# EAGLE design wifi_fixer (EAGLE 9.5.2)
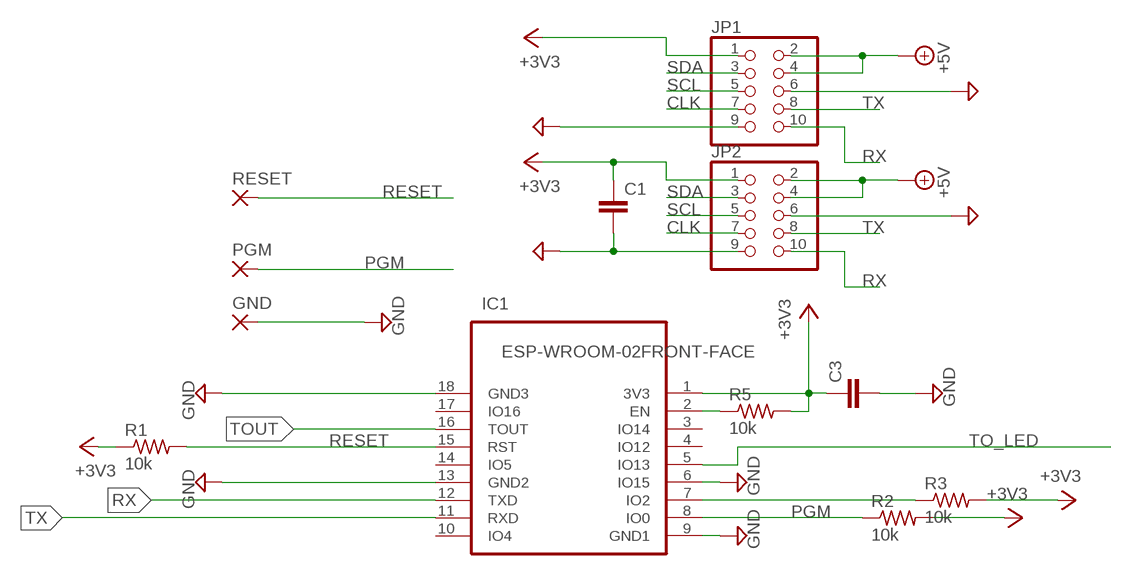
[diagram p0: schematic, sheet 1]

## Parts
C1  C-EUC1206  [C1206]
C3  C-EUC0603  [C0603]
GND  SMD2  [SMD1,27-2,54]
IC1  ESP-WROOM-02FRONT-FACE  [FRONT-FACE]
JP1  PINHD-2X5  [2X05]
JP2  PINHD-2X5  [2X05]
PGM  SMD2  [SMD1,27-2,54]
R1  10k  R-US_R0603  [R0603]
R2  10k  R-US_R0603  [R0603]
R3  10k  R-US_R0603  [R0603]
R5  10k  R-US_R0603  [R0603]
RESET  SMD2  [SMD1,27-2,54]

## Nets
+3V3: C1.1 C3.1 IC1.1(3V3) JP1.1 JP2.1 R1.1 R2.2 R3.2 R5.2
+5V: JP1.2 JP1.4 JP2.2 JP2.4
CLK: JP1.7 JP2.7
GND: C1.2 C3.2 GND.1(P) IC1.6(IO15) IC1.9(GND1) IC1.13(GND2) IC1.18(GND3) JP1.6 JP1.9 JP2.6 JP2.9
N$2: IC1.7(IO2) R3.1
N$5: IC1.2(EN) R5.1
PGM: IC1.8(IO0) PGM.1(P) R2.1
RESET: IC1.15(RST) R1.2 RESET.1(P)
RX: IC1.12(TXD) JP1.10 JP2.10
SCL: JP1.5 JP2.5
SDA: JP1.3 JP2.3
TO_LED: IC1.5(IO13)
TOUT: IC1.16(TOUT)
TX: IC1.11(RXD) JP1.8 JP2.8
Unconnected: IC1.3(IO14) IC1.4(IO12) IC1.10(IO4) IC1.14(IO5) IC1.17(IO16)

## Library data of the parts
C1 C3 = rcl:C-EU: CAPACITOR, European symbol
GND PGM RESET = wirepad:SMD2: SMD PAD
IC1 = esp-wroom-02:ESP-WROOM-02: WiFi module - ESP-WROOM-02
JP1 JP2 = pinhead:PINHD-2X5: PIN HEADER
R1-R3 R5 = rcl:R-US_: RESISTOR, American symbol

## Board
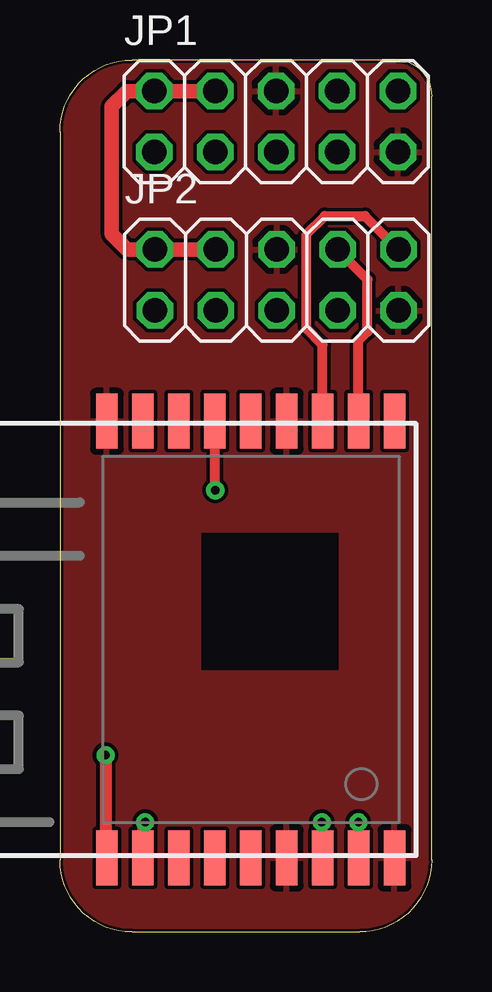
[diagram p1: board, top side]
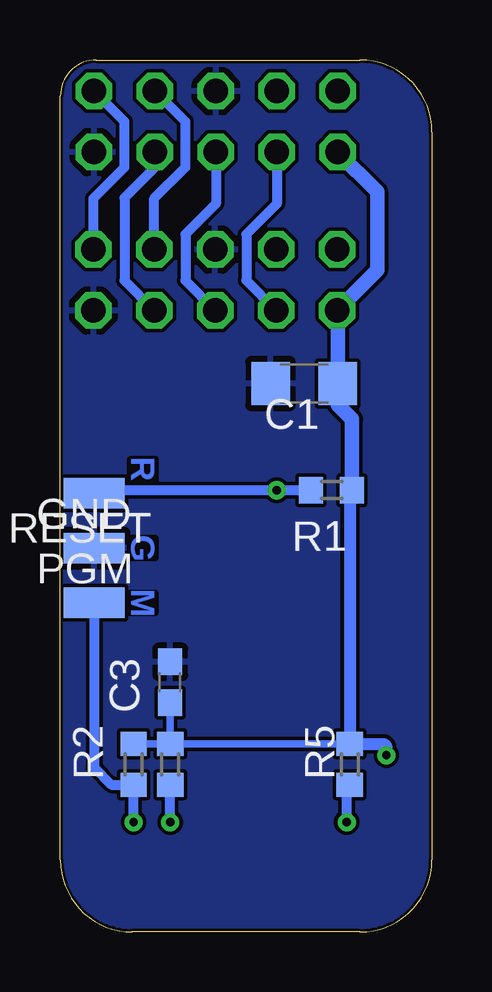
[diagram p2: board, bottom side, seen from below]

Size 15.5 x 36.35 mm. Coordinates in mm from the lower left corner, seen from the top.
Outline: 3,0 12.5,0 arc90 15.5,3 15.5,34.85 arc90 14,36.35 3,36.35 arc90 0,33.35 0,3 arc90 3,0
Copper layers (1*16): Top 0.035mm / dielectric 0.15mm / Bottom 0.035mm
Design rules "default *": minimum track width 6mil, minimum drill 0.35mm, track to track 6mil, track to pad 6mil, pad to pad 6mil, via to via 6mil, smd to smd 6mil, copper to edge 5mil, drill to drill 6mil, minimum pad ring 10mil, minimum via ring 8mil, stop-mask expansion 4mil, vias tented up to drill 0mil, thermal gap 10mil

### Footprints (pad centres in the part's own frame; a part is rotated, then mirrored left to right if it is on the bottom)
C1206 = smd 1.6 x 1.8: 1 -1.4,0; 2 1.4,0
C0603 = smd 1.1 x 1: 1 -0.85,0; 2 0.85,0
SMD1,27-2,54 = smd 1.27 x 2.54: 1 0,0
FRONT-FACE = smd 2.3 x 0.9: 1 -9.1,4.9; 2 -9.1,3.4; 3 -9.1,1.9; 4 -9.1,0.4; 5 -9.1,-1.1; 6 -9.1,-2.6; 7 -9.1,-4.1; 8 -9.1,-5.6; 9 -9.1,-7.1; 10 9.1,-7.1; 11 9.1,-5.6; 12 9.1,-4.1; 13 9.1,-2.6; 14 9.1,-1.1; 15 9.1,0.4; 16 9.1,1.9; 17 9.1,3.4; 18 9.1,4.9
2X05 = drill 1.016 octagon: 1 -5.08,-1.27; 2 -5.08,1.27; 3 -2.54,-1.27; 4 -2.54,1.27; 5 0,-1.27; 6 0,1.27; 7 2.54,-1.27; 8 2.54,1.27; 9 5.08,-1.27; 10 5.08,1.27
R0603 = smd 1 x 1.1: 1 -0.85,0; 2 0.85,0

### Placement (x,y rotation side)
C1  5.33,22.86 180 bottom
C3  10.92,10.41 90 bottom
GND  14.1,16 270 bottom
IC1  6.86,12.19 90 top
JP1  9.02,33.78 0 top
JP2  9.04,27.18 0 top
PGM  14.1,13.72 270 bottom
R1  4.19,18.41 180 bottom
R2  12.45,6.99 90 bottom
R3  10.92,6.99 90 bottom
R5  3.43,6.99 90 bottom
RESET  14.1,18.29 90 bottom

### Tracks (layer width: path | path; a pad name or v marks a point on that pad's centre or on a via)
+3V3  (via drill 0.35)
  Top 0.508: v1.91,7.37 1.91,3.15 IC1.1
  Bottom 0.305: R5.2 R3.2 | R3.2 C3.1 | R2.2 R3.2
  Bottom 0.508: R1.1 3.43,18.33 R5.2 1.99,7.83 1.91,7.75 v1.91,7.37
  Bottom 0.61: JP1.1 2.29,30.86 2.29,27.58 JP2.1 3.93,25.88 C1.1 3.93,21.97 3.34,21.38 R1.1
+5V
  Top 0.61: JP1.4 JP1.2 2.79,35.05 2.16,34.42 2.16,29.08 2.79,28.45 JP2.2 JP2.4
CLK
  Bottom 0.406: JP1.7 11.56,31.88 12.83,30.61 12.83,27.15 JP2.7
GND
  pour Top: -1.02,38.1 17.02,38.1 17.02,-1.78 -1.02,-1.78
  pour Bottom: -2.03,38.35 16.51,38.35 16.51,-2.03 -2.03,-2.03
N$2  (via drill 0.35)
  Top 0.406: IC1.7 10.96,4.54 v10.92,4.57
  Bottom 0.406: v10.92,4.57 R3.1
N$5  (via drill 0.35)
  Top 0.406: IC1.2 3.46,4.35 3.56,4.45 v3.56,4.57
  Bottom 0.406: v3.56,4.57 3.56,6.01 R5.1
PGM  (via drill 0.35)
  Top 0.406: IC1.8 v12.46,4.56 v12.45,4.57
  Bottom 0.406: v12.45,4.57 R2.1 13.37,6.13 14.1,6.86 PGM.1 15.11,13.72
RESET  (via drill 0.35)
  Top 0.406: IC1.15 6.46,18.43 v6.48,18.41
  Bottom 0.406: R1.2 v6.48,18.41 13.97,18.41 RESET.1
RX
  Top 0.406: IC1.12 10.96,24.48 10.29,25.15 10.29,29.08 11.05,29.84 12.72,29.84 JP2.10
  Bottom 0.406: JP2.10 14.12,30.58 12.83,31.88 12.83,33.78 JP1.10
SCL
  Bottom 0.406: JP1.5 9.02,30.35 10.29,29.08 10.29,27.15 JP2.5
SDA
  Bottom 0.406: JP1.3 6.48,30.35 7.75,29.08 7.75,27.15 JP2.3
TX
  Top 0.406: IC1.11 12.46,24.65 12.83,25.02 12.83,27.2 JP2.8
  Bottom 0.406: JP2.8 11.58,30.58 10.29,31.88 10.29,33.78 JP1.8

### Text on the board
Bottom: R | G | M
Document: WiFi_FIXer | nekotorobot.com